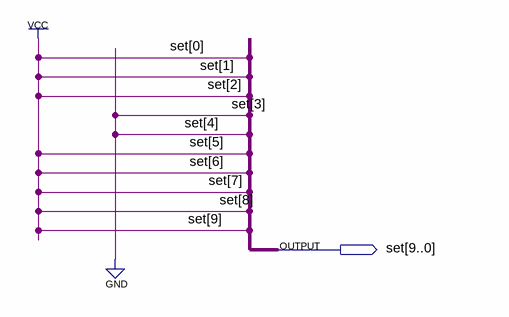
[diagram p0: schematic sheet]
// Quartus schematic num_10b_999d.bdf as structural Verilog: 0 symbols, 1 pins
module num_10b_999d (
  output [9:0] set
);


  assign set = 10'b1111100111;
endmodule
